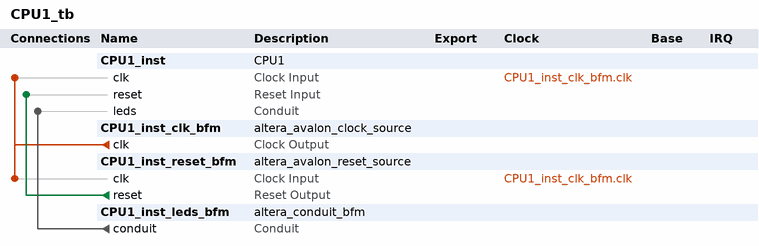
[diagram p0: system contents]
# Platform Designer (Qsys) system CPU1_tb, Cyclone V 5CGXFC7C6F23I7
# Parameters at their usual value, and those the tool derives, are not listed.
package require -exact qsys 18.1
create_system CPU1_tb
set_project_property DEVICE_FAMILY {Cyclone V}
set_project_property DEVICE 5CGXFC7C6F23I7

add_instance CPU1_inst CPU1 1.0

add_instance CPU1_inst_clk_bfm altera_avalon_clock_source 18.1

add_instance CPU1_inst_reset_bfm altera_avalon_reset_source 18.1
set_instance_parameter_value CPU1_inst_reset_bfm ASSERT_HIGH_RESET 0
set_instance_parameter_value CPU1_inst_reset_bfm INITIAL_RESET_CYCLES 50

add_instance CPU1_inst_leds_bfm altera_conduit_bfm 18.1
set_instance_parameter_value CPU1_inst_leds_bfm CLOCKED_SIGNAL false
set_instance_parameter_value CPU1_inst_leds_bfm ENABLE_RESET false
set_instance_parameter_value CPU1_inst_leds_bfm SIGNAL_DIRECTIONS input
set_instance_parameter_value CPU1_inst_leds_bfm SIGNAL_WIDTHS 2

# connections
add_connection CPU1_inst_clk_bfm.clk CPU1_inst.clk clock
add_connection CPU1_inst_clk_bfm.clk CPU1_inst_reset_bfm.clk clock
add_connection CPU1_inst_reset_bfm.reset CPU1_inst.reset reset
add_connection CPU1_inst_leds_bfm.conduit CPU1_inst.leds conduit

set_interconnect_requirement {$system} qsys_mm.clockCrossingAdapter HANDSHAKE
set_interconnect_requirement {$system} qsys_mm.enableEccProtection FALSE
set_interconnect_requirement {$system} qsys_mm.insertDefaultSlave FALSE
set_interconnect_requirement {$system} qsys_mm.maxAdditionalLatency 1

save_system CPU1_tb.qsys
